# Altium schematic sheet Motor_driver.SchDoc
size A4; SheetNumber: 3; SheetTotal: 7
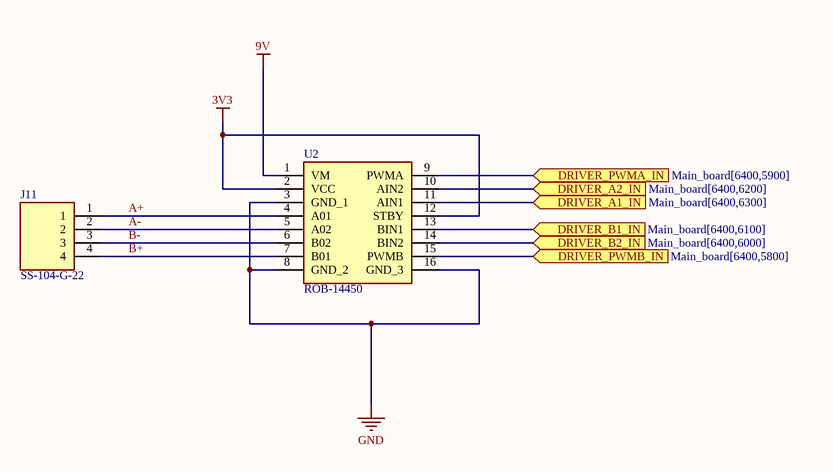
[diagram p0: Motor_driver.SchDoc]

## Parts
J11  SS-104-G-22  [PCB 4 PIN PADS]
U2  ROB-14450  [ROB14450]

## Ports
DRIVER_A1_IN (in, see Main_board[6400,6300]), DRIVER_A2_IN (in, see Main_board[6400,6200]), DRIVER_B1_IN (in, see Main_board[6400,6100]), DRIVER_B2_IN (in, see Main_board[6400,6000]), DRIVER_PWMA_IN (in, see Main_board[6400,5900]), DRIVER_PWMB_IN (in, see Main_board[6400,5800])

## Nets
3V3: U2.2(VCC) U2.12(STBY)
9V: U2.1(VM)
GND: U2.3(GND_1) U2.8(GND_2) U2.16(GND_3)
A+: J11.1 U2.4(A01)
A-: J11.2 U2.5(A02)
B+: J11.4 U2.7(B01)
B-: J11.3 U2.6(B02)
DRIVER_A1_IN: U2.11(AIN1) ; port DRIVER_A1_IN
DRIVER_A2_IN: U2.10(AIN2) ; port DRIVER_A2_IN
DRIVER_B1_IN: U2.13(BIN1) ; port DRIVER_B1_IN
DRIVER_B2_IN: U2.14(BIN2) ; port DRIVER_B2_IN
DRIVER_PWMA_IN: U2.9(PWMA) ; port DRIVER_PWMA_IN
DRIVER_PWMB_IN: U2.15(PWMB) ; port DRIVER_PWMB_IN

## Library data of the parts
J11 = SS-104-G-22: Connector; Manufacturer_Name: SAMTEC; Datasheet Link: http://suddendocs.samtec.com/prints/sx-1xx-xx-xx-x-x-mkt.pdf; Height: 4.44mm; Manufacturer_Part_Number: SS-104-G-22
U2 = ROB-14450: Undefined or Miscellaneous; Manufacturer_Name: SparkFun; Datasheet Link: https://www.sparkfun.com/products/14450; Height: 5mm; Manufacturer_Part_Number: ROB-14450; Mouser Part Number: 474-ROB-14450; Mouser Price/Stock: https://www.mouser.co.uk/ProductDetail/SparkFun/ROB-14450?qs=wd5RIQLrsJhQdlH%2FW5H2aQ%3D%3D; Arrow Part Number: ROB-14450; Arrow Price/Stock: https://www.arrow.com/en/products/rob-14450/sparkfun-electronics?region=nac